# EAGLE schematic NAME_of_the_Game_(Arduino_AND_Gate_Emulator_System)_v1 (EAGLE 9.7.0)

## Sheet 1 of 2
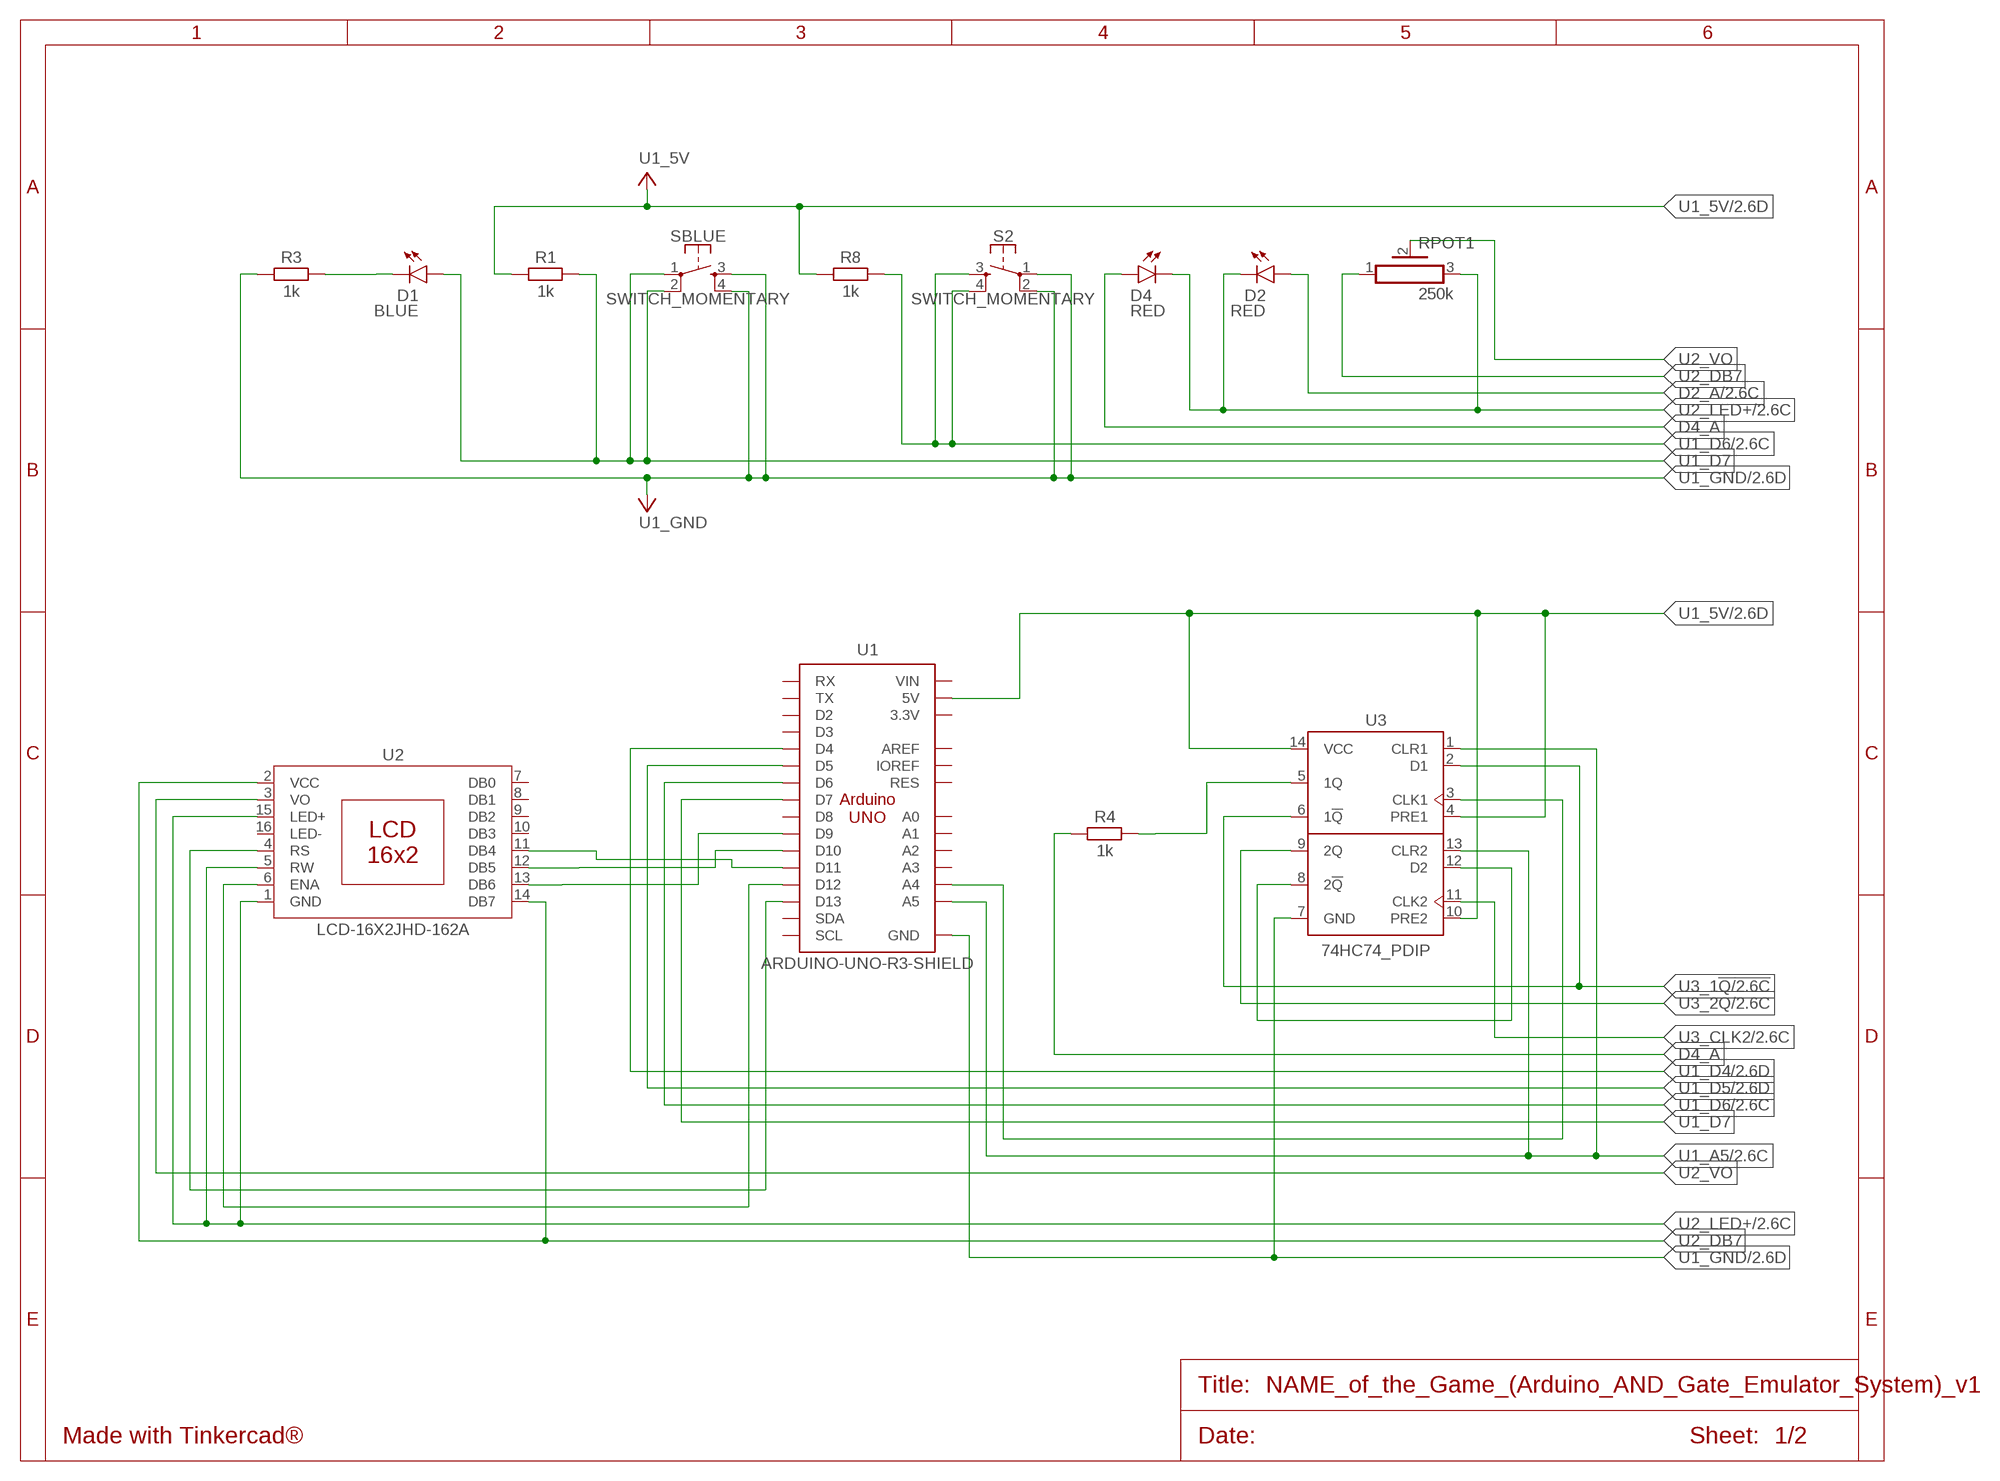
[diagram p0: schematic, sheet 1]

### Parts
D1  BLUE  LED_RADIAL_BLUE  [LEDRD254W60D565H860B_B]
D2  RED  LED_RADIAL_RED  [LEDRD254W60D565H860B]
D4  RED  LED_RADIAL_RED  [LEDRD254W60D565H860B]
R1  1k  RESISTOR_AXIAL-10.16MM-PITCH  [RESAD1016W63L850D250B]
R3  1k  RESISTOR_AXIAL-10.16MM-PITCH  [RESAD1016W63L850D250B]
R4  1k  RESISTOR_AXIAL-10.16MM-PITCH  [RESAD1016W63L850D250B]
R8  1k  RESISTOR_AXIAL-10.16MM-PITCH  [RESAD1016W63L850D250B]
RPOT1  250k  POT_HA-06  [HA-06-SM065]
S2  SWITCH_MOMENTARY  [SWITCH-MOMENTARY-PTH-6.5MM]
SBLUE  SWITCH_MOMENTARY  [SWITCH-MOMENTARY-PTH-6.5MM]
U1  ARDUINO-UNO-R3-SHIELD  [ARDUINO-UNO-R3-SHIELD]
U2  LCD-16X2JHD-162A  [JHD-162A]
U3  74HC74_PDIP  [DIP762W53P254L1969H508Q14B]

### Nets
D1_C: D1.2(C) R3.1
D2_A: D2.1(A) ; also sheet 2
D4_A: D4.1(A) R4.2
U1_5V: R1.1 R8.1 U1.5V U3.4(PRE1) U3.10(PRE2) U3.14(VCC) ; also sheet 2
U1_A4: U1.A4 U3.3(CLK1)
U1_A5: U1.A5 U3.1(CLR1) U3.13(CLR2) ; also sheet 2
U1_D4: U1.D4 ; also sheet 2
U1_D5: U1.D5 ; also sheet 2
U1_D6: R8.2 S2.3 S2.4 U1.D6 ; also sheet 2
U1_D7: D1.1(A) R1.2 SBLUE.1 SBLUE.2 U1.D7
U1_D9: U1.D9 U2.13(DB6)
U1_D10: U1.D10 U2.12(DB5)
U1_D11: U1.D11 U2.11(DB4)
U1_D12: U1.D12 U2.6(ENA)
U1_D13: U1.D13 U2.4(RS)
U1_GND: R3.2 S2.1 S2.2 SBLUE.3 SBLUE.4 U1.GND@0(GND) U1.GND@1(GND) U1.GND@2(GND) U3.7(GND) ; also sheet 2
U2_DB7: RPOT1.1 U2.2(VCC) U2.14(DB7)
U2_LED+: D2.2(C) D4.2(C) RPOT1.3 U2.1(GND) U2.5(RW) U2.15(LED+) ; also sheet 2
U2_VO: RPOT1.2 U2.3(VO)
U3_1!Q: U3.2(D1) U3.6(1!Q) ; also sheet 2
U3_1Q: R4.1 U3.5(1Q)
U3_2!Q: U3.8(2!Q) U3.12(D2)
U3_2Q: U3.9(2Q) ; also sheet 2
U3_CLK2: U3.11(CLK2) ; also sheet 2
Unconnected: U1.3.3V U1.A0 U1.A1 U1.A2 U1.A3 U1.AREF U1.D2 U1.D3 U1.D8 U1.IOREF U1.RES U1.RX U1.SCL U1.SDA U1.TX U1.VIN U2.7(DB0) U2.8(DB1) U2.9(DB2) U2.10(DB3) U2.16(LED-)

## Sheet 2 of 2
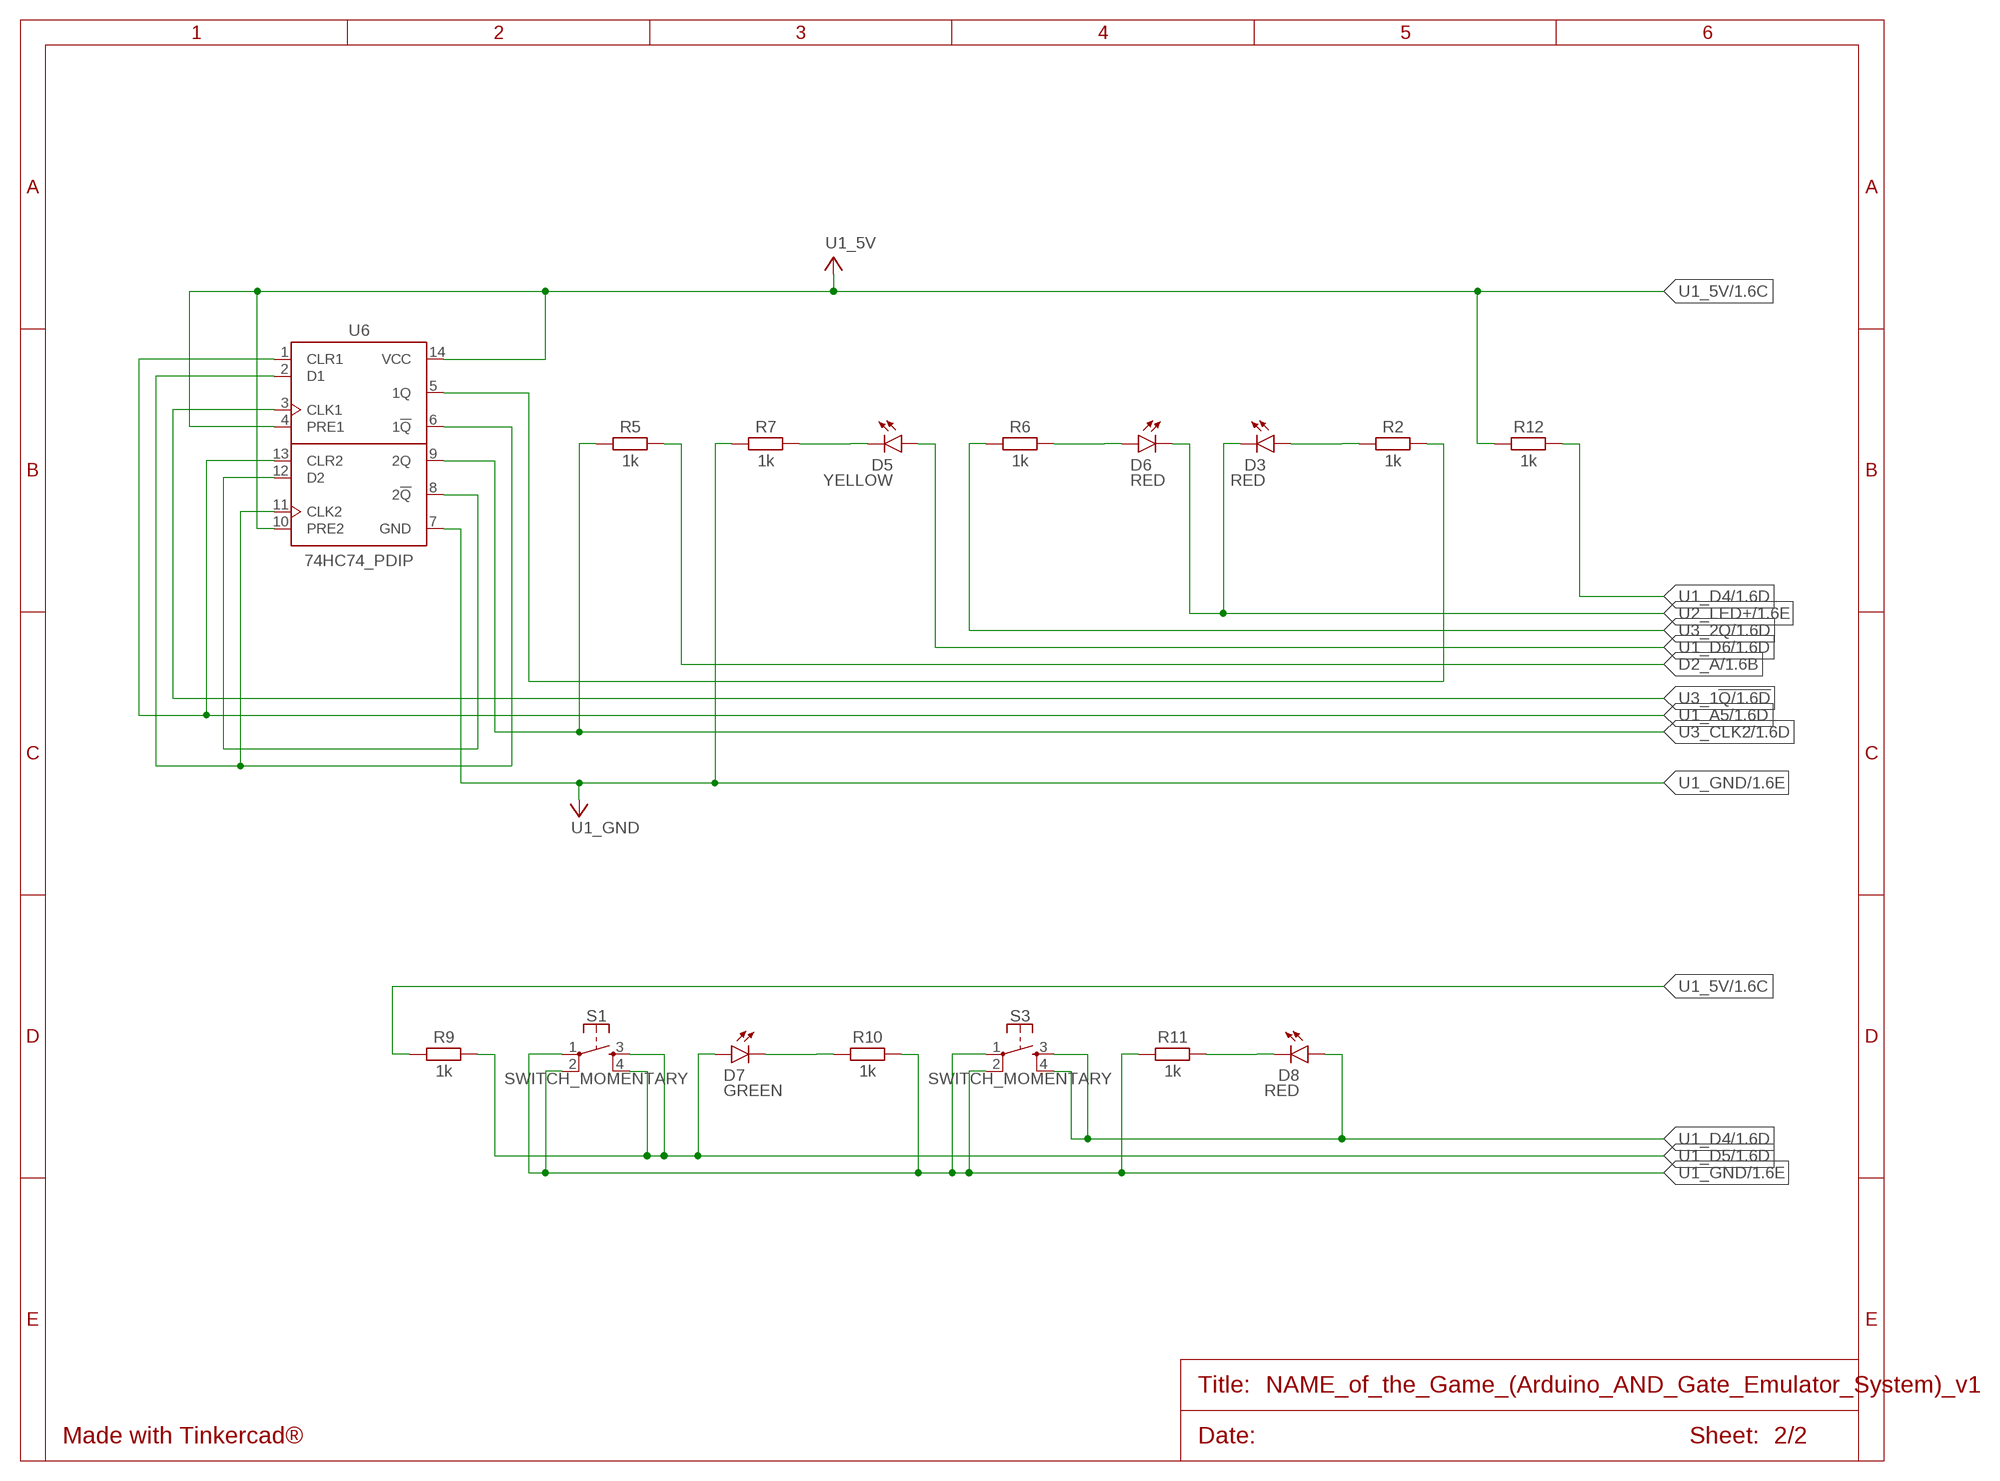
[diagram p1: schematic, sheet 2]

### Parts
D3  RED  LED_RADIAL_RED  [LEDRD254W60D565H860B]
D5  YELLOW  LED_RADIAL_YELLOW  [LEDRD254W60D565H860B_Y]
D6  RED  LED_RADIAL_RED  [LEDRD254W60D565H860B]
D7  GREEN  LED_RADIAL_GREEN  [LEDRD254W60D565H860B_G]
D8  RED  LED_RADIAL_RED  [LEDRD254W60D565H860B]
R2  1k  RESISTOR_AXIAL-10.16MM-PITCH  [RESAD1016W63L850D250B]
R5  1k  RESISTOR_AXIAL-10.16MM-PITCH  [RESAD1016W63L850D250B]
R6  1k  RESISTOR_AXIAL-10.16MM-PITCH  [RESAD1016W63L850D250B]
R7  1k  RESISTOR_AXIAL-10.16MM-PITCH  [RESAD1016W63L850D250B]
R9  1k  RESISTOR_AXIAL-10.16MM-PITCH  [RESAD1016W63L850D250B]
R10  1k  RESISTOR_AXIAL-10.16MM-PITCH  [RESAD1016W63L850D250B]
R11  1k  RESISTOR_AXIAL-10.16MM-PITCH  [RESAD1016W63L850D250B]
R12  1k  RESISTOR_AXIAL-10.16MM-PITCH  [RESAD1016W63L850D250B]
S1  SWITCH_MOMENTARY  [SWITCH-MOMENTARY-PTH-6.5MM]
S3  SWITCH_MOMENTARY  [SWITCH-MOMENTARY-PTH-6.5MM]
U6  74HC74_PDIP  [DIP762W53P254L1969H508Q14B]

### Nets
D2_A: R5.2 ; also sheet 1
D3_A: D3.1(A) R2.2
D5_C: D5.2(C) R7.1
D6_A: D6.1(A) R6.2
D7_C: D7.2(C) R10.1
D8_C: D8.2(C) R11.1
U1_5V: R9.1 R12.1 U6.4(PRE1) U6.10(PRE2) U6.14(VCC) ; also sheet 1
U1_A5: U6.1(CLR1) U6.13(CLR2) ; also sheet 1
U1_D4: D8.1(A) R12.2 S3.3 S3.4 ; also sheet 1
U1_D5: D7.1(A) R9.2 S1.3 S1.4 ; also sheet 1
U1_D6: D5.1(A) ; also sheet 1
U1_GND: R7.2 R10.2 R11.2 S1.1 S1.2 S3.1 S3.2 U6.7(GND) ; also sheet 1
U2_LED+: D3.2(C) D6.2(C) ; also sheet 1
U3_1!Q: U6.3(CLK1) ; also sheet 1
U3_2Q: R6.1 ; also sheet 1
U3_CLK2: R5.1 U6.9(2Q) ; also sheet 1
U6_1!Q: U6.2(D1) U6.6(1!Q) U6.11(CLK2)
U6_1Q: R2.1 U6.5(1Q)
U6_2!Q: U6.8(2!Q) U6.12(D2)

## Library data of the parts
D1 = Tinkercad:LED_RADIAL: LED - Generic; CATEGORY: Opto-Electronic; SUB-CATEGORY: LED; VALUE: LED_BLUE
D2-D4 D6 D8 = Tinkercad:LED_RADIAL: LED - Generic; CATEGORY: Opto-Electronic; SUB-CATEGORY: LED; VALUE: LED_RED
D5 = Tinkercad:LED_RADIAL: LED - Generic; CATEGORY: Opto-Electronic; SUB-CATEGORY: LED; VALUE: LED_YELLOW
D7 = Tinkercad:LED_RADIAL: LED - Generic; CATEGORY: Opto-Electronic; SUB-CATEGORY: LED; VALUE: LED_GREEN
R1-R12 = Tinkercad:RESISTOR: Resistor Fixed - Generic
RPOT1 = Tinkercad:POT: Rectangular Trimmer Potentiometers - PV36 Series Datasheet <https://www.bourns.com/docs/Product-Datasheets/pv36.pdf>
S1-S3 SBLUE = Tinkercad:SWITCH_MOMENTARY
U1 = Tinkercad:ARDUINO-UNO-R3-SHIELD
U2 = Tinkercad:LCD-16X2
U3 U6 = Tinkercad:74HC74: Dual D flip-flop with Clear and Preset Reference Datasheet <https://www.ti.com/lit/ds/symlink/sn74hc74.pdf?ts=1637643844925&ref_url=https%253A%252F%252Fwww.google.com%252F>